# Altium schematic sheet Schild.schdoc
size 154 x 130 mm
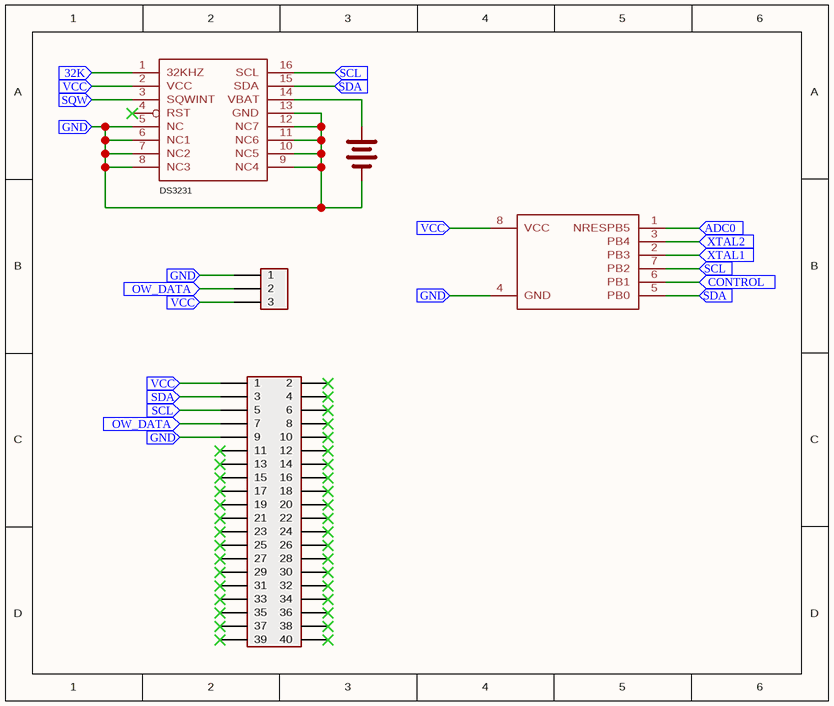
[diagram p0: Schild.schdoc]

## Parts
(Parts that share a designator on the sheet are numbered #1, #2 ... from top to bottom, then left to right.)
?#1  (no value)  [S016W]
?#2  (no value)  [BATTERY-1]
?#3  (no value)  [SOIC8_EIAJ_208MIL]
?#4  (no value)  [HDR-3X1/2.54]
?#5  (no value)  [HDR-20X2/2.54]

## Ports
32K, ADC0, CONTROL, GND, OW_DATA, SCL, SDA, SQW, VCC, XTAL1, XTAL2

## Nets
32K: ?#1.1(32KHZ) ; port 32K
ADC0: ?#3.1(NRESPB5) ; port ADC0
CONTROL: ?#3.6(PB1) ; port CONTROL
GND: ?#1.5(NC) ?#1.6(NC1) ?#1.7(NC2) ?#1.8(NC3) ?#1.9(NC4) ?#1.10(NC5) ?#1.11(NC6) ?#1.12(NC7) ?#1.13(GND) ?#2.2 ?#3.4(GND) ?#4.1 ?#5.9 ; port GND
OW_DATA: ?#4.2 ?#5.7 ; port OW_DATA
SCL: ?#1.16(SCL) ?#3.7(PB2) ?#5.5 ; port SCL
SDA: ?#1.15(SDA) ?#3.5(PB0) ?#5.3 ; port SDA
SQW: ?#1.3(SQWINT) ; port SQW
VCC: ?#1.2(VCC) ?#3.8(VCC) ?#4.3 ?#5.1 ; port VCC
XTAL1: ?#3.2(PB3) ; port XTAL1
XTAL2: ?#3.3(PB4) ; port XTAL2
Net?#1_14: ?#1.14(VBAT) ?#2.1

Not connected (* = marked no-connect by the designer): ?#1 4(RST)*; ?#5 2* 4* 6* 8* 10* 11* 12* 13* 14* 15* 16* 17* 18* 19* 20* 21* 22* 23* 24* 25* 26* 27* 28* 29* 30* 31* 32* 33* 34* 35* 36* 37* 38* 39* 40*

## Notes on the sheet
- (in symbol ?) DS3231

## Library data of the parts
?#1 = (no symbol name): catid: 20; Contributor: Adafruit; sourceId: RDPbiECmk; BOM_Manufacturer Part: ?; spicePre: U
?#2 = (no symbol name): nameAlias: Value; BOM_Manufacturer Part: ?; spicePre: V; spiceSymbolName: Battery
?#3 = (no symbol name): catid: 20; BOM_Manufacturer Part: ?; spicePre: U
?#4 = (no symbol name): BOM_Manufacturer: LCSC; BOM_Manufacturer Part: Header-Male-2.54_1x3; BOM_LCSC: C49257; BOM_Supplier: LCSC; spicePre: P
?#5 = (no symbol name): BOM_Manufacturer: LCSC; BOM_Manufacturer Part: Header-Male-2.54_2x20; BOM_LCSC: C50980; BOM_Supplier: LCSC; spicePre: P